# EAGLE schematic LiPo_Charger_MCP73831 (EAGLE 6.1)
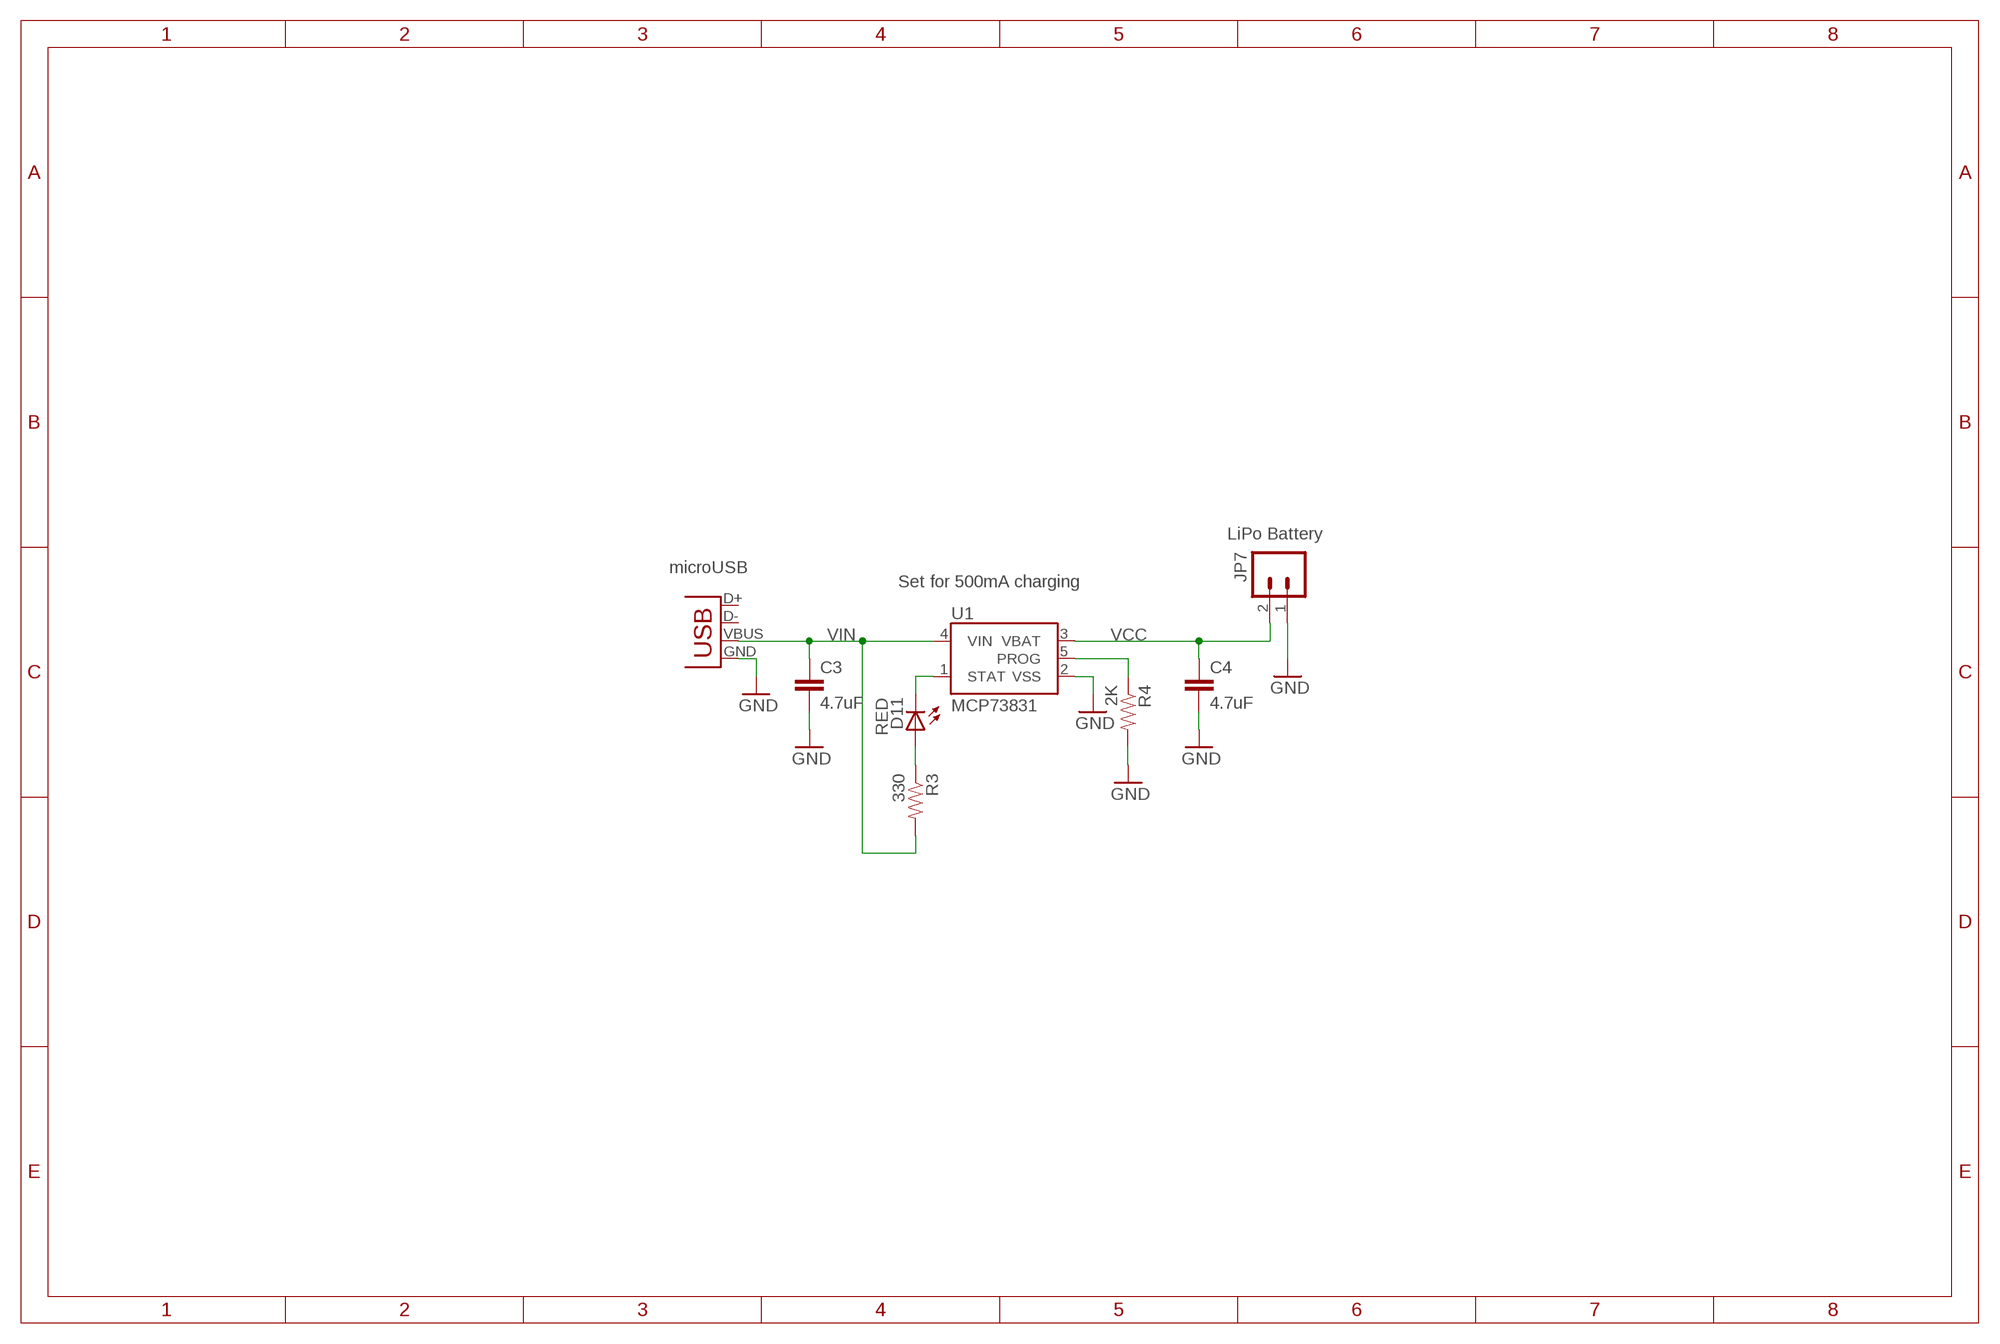
[diagram p0: schematic, sheet 1]

## Parts
C3  4.7uF  CAP0402-CAP  [0402-CAP]
C4  4.7uF  CAP0402-CAP  [0402-CAP]
D11  RED  LED0603  [LED-0603]
JP7  LiPo Battery  M02-JST-2MM-SMT  [JST-2-SMD]
R3  330  RESISTOR0402-RES  [0402-RES]
R4  2K  RESISTOR0402-RES  [0402-RES]
U1  MCP73831  [SOT23-5]
X1  Micro USB  USB-MICROB  [USB-MICROB]

## Nets
GND: C3.2 C4.2 JP7.1 R4.2 U1.2(VSS) X1.GND
N$3: D11.A R3.1
PROG: R4.1 U1.5(PROG)
STAT: D11.C U1.1(STAT)
VCC: C4.1 JP7.2 U1.3(VBAT)
VIN: C3.1 R3.2 U1.4(VIN) X1.VBUS
Unconnected: X1.D+ X1.D-

## Notes on the sheet
- microUSB
- Set for 500mA charging

## Library data of the parts
C3 C4 = SparkFun:CAP: Capacitor Standard 0603 ceramic capacitor, and 0.1" leaded capacitor.
D11 = SparkFun:LED: LEDs Standard schematic elements and footprints for 5mm, 3mm, 1206, and 0603 sized LEDs. 5mm - Spark Fun Electronics SKU : COM-00529 (and others)
JP7 = SparkFun:M02: Header 2 Standard 2-pin 0.1" header. Use with straight break away headers (SKU : PRT-00116), right angle break away headers (PRT-00553), swiss pins (PRT-00743), machine pins (PRT-00117), and female headers (PRT-00115). Molex polarized connector foot print use with SKU : PRT-08233 with associated crimp pins and housings.
R3 R4 = SparkFun:RESISTOR: Resistor Basic schematic elements and footprints for 0603, 1206, and PTH resistors.
U1 = SparkFun:MCP73831: Microchip's MCP73831 Miniature single cell, fully integrated Li-Ion, Li-polymer charge management controller http://ww1.microchip.com/downloads/en/DeviceDoc/21984a.pdf
X1 = SparkFun:USB: USB Connectors USB-B-PTH is fully proven SKU : PRT-00139 USB-miniB is fully proven SKU : PRT-00587 USB-A-PCB is untested. USB-A-H is throughly reviewed, but untested. Spark Fun Electronics SKU : PRT-00437 USB-B-SMT is throughly reviewed, but untested. Needs silkscreen touching up. USB-A-S has not been used/tested USB-MB-H has not been used/tested